# EAGLE design flying-blind-v3 (EAGLE 9.7.0)
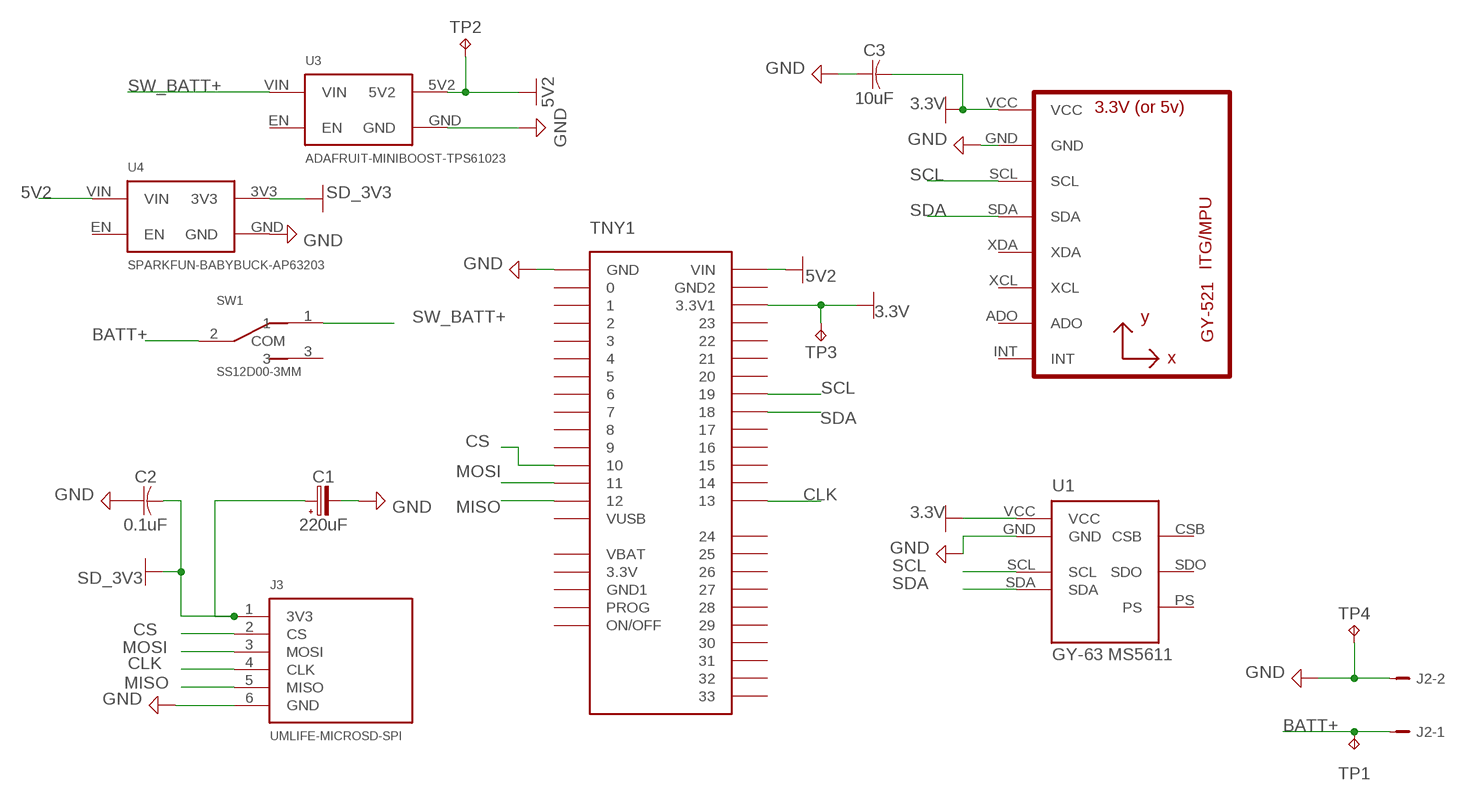
[diagram p0: schematic, sheet 1]

## Parts
C1  220uF  C-POLRADIAL-6.3MM-DIA  [CAPPRD250W80D630H800B]
C2  0.1uF  C-US_CHIP-1206(3216-METRIC)  [CAPC3216X135]
C3  10uF  C-US_CHIP-1206(3216-METRIC)  [CAPC3216X135]
J2  B2B-PH-K-S  [B2B-PH-K-S]
J3  UMLIFE-MICROSD-SPI  [UMLIFE-MICROSD-FINAL]
SW1  SS12D00-3MM  [SS12D00-3MM]
TNY1  Teensy 4.0  TEENSY4.0  [TEENSY4.0]
TP1  TPTP127R  [TP127R]
TP2  TPTP127R  [TP127R]
TP3  TPTP127R  [TP127R]
TP4  TPTP127R  [TP127R]
U1  GY-63 MS5611  GY-63-MS5611  [GY-63-MS5611-7P]
U2  GY-521MPU6050  [GY-521]
U3  ADAFRUIT-MINIBOOST-TPS61023  [ADAFRUIT-MINIBOOST-TPS61023]
U4  SPARKFUN-BABYBUCK-AP63203  [BABYBUCK-AP63203]

## Nets
3.3V: C3.2 TNY1.3.31(3.3V1) TP3.TP U1.VCC U2.VCC
5V2: TNY1.VIN TP2.TP U3.5V2 U4.VIN
BATT+: J2.1 SW1.2(COM) TP1.TP
CLK: J3.4(CLK) TNY1.13
CS: J3.2(CS) TNY1.10
GND: C1.2(-) C2.1 C3.1 J2.2 J3.6(GND) TNY1.GND TP4.TP U1.GND U2.GND U3.GND U4.GND
MISO: J3.5(MISO) TNY1.12
MOSI: J3.3(MOSI) TNY1.11
SCL: TNY1.19 U1.SCL U2.SCL
SD_3V3: C1.1(+) C2.2 J3.1(3V3) U4.3V3
SDA: TNY1.18 U1.SDA U2.SDA
SW_BATT+: SW1.1 U3.VIN
Unconnected: SW1.3 TNY1.0 TNY1.1 TNY1.2 TNY1.3 TNY1.3.30(3.3V) TNY1.4 TNY1.5 TNY1.6 TNY1.7 TNY1.8 TNY1.9 TNY1.14 TNY1.15 TNY1.16 TNY1.17 TNY1.20 TNY1.21 TNY1.22 TNY1.23 TNY1.24 TNY1.25 TNY1.26 TNY1.27 TNY1.28 TNY1.29 TNY1.30 TNY1.31 TNY1.32 TNY1.33 TNY1.GND1 TNY1.GND2 TNY1.ON/OFF TNY1.PROG TNY1.VBAT TNY1.VUSB U1.CSB U1.PS U1.SDO U2.ADO U2.INT U2.XCL U2.XDA U3.EN U4.EN

## Library data of the parts
C1 = Capacitor:C-POL: Capacitor Polarised - Generic
C2 C3 = Capacitor:C-US: Capacitor - ANSI
J2 = con-JST-PH:B2B-PH-K-S: JST-PH 2-way vertical TH
J3 = UMLIFE_MicroSD_Final_Measured:UMLIFE-MICROSD-SPI
SW1 = Jersvimc_SS12D00_3mm_Slide_Switch:SS12D00-3MM: SPDT 2-position slide switch. Physical terminal 2 is common; slider connects terminal 2 to terminal 1 or terminal 3 depending on position.
TNY1 = Phils teensy:TEENSY4.0
TP1-TP4 = PCB_Utilities:TP: Test Pad
U1 = GY-63_MS5611:GY-63-MS5611: GY-63 breakout using the MS5611 pressure sensor. Header order: VCC, GND, SCL, SDA, CSB, SDO, PS.
U2 = gy-521:GY-521
U3 = Adafruit_MiniBoost_TPS61023_4654:ADAFRUIT-MINIBOOST-TPS61023: Adafruit MiniBoost 5.2V @ 1A TPS61023, Product 4654. Carrier-module device.
U4 = SparkFun_BabyBuck_AP63203_COM-18357:SPARKFUN-BABYBUCK-AP63203: SparkFun BabyBuck 3.3V synchronous buck regulator breakout, AP63203, COM-18357.

## Board
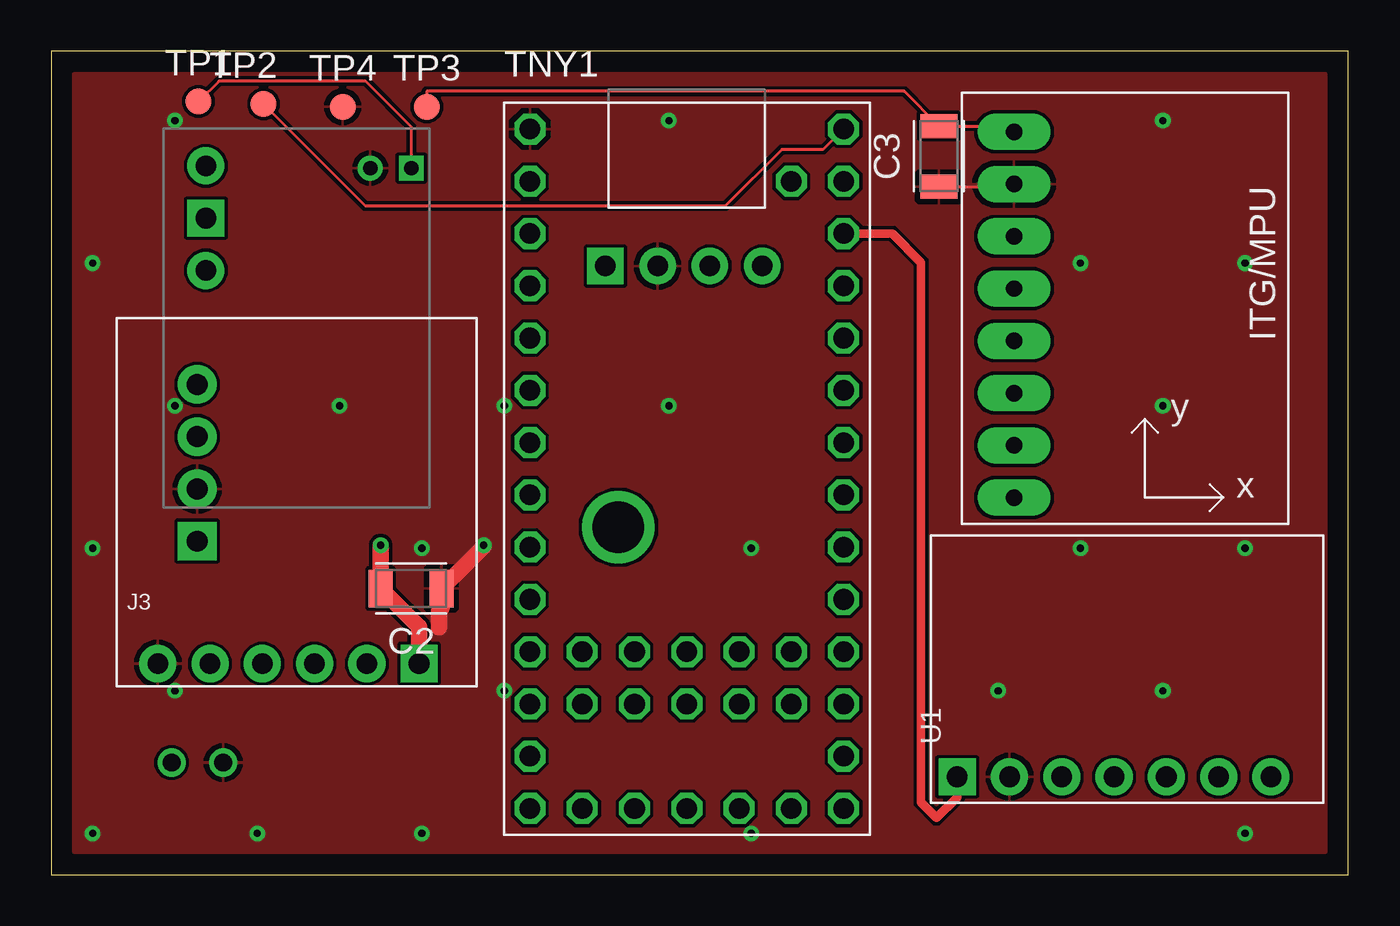
[diagram p1: board, top side]
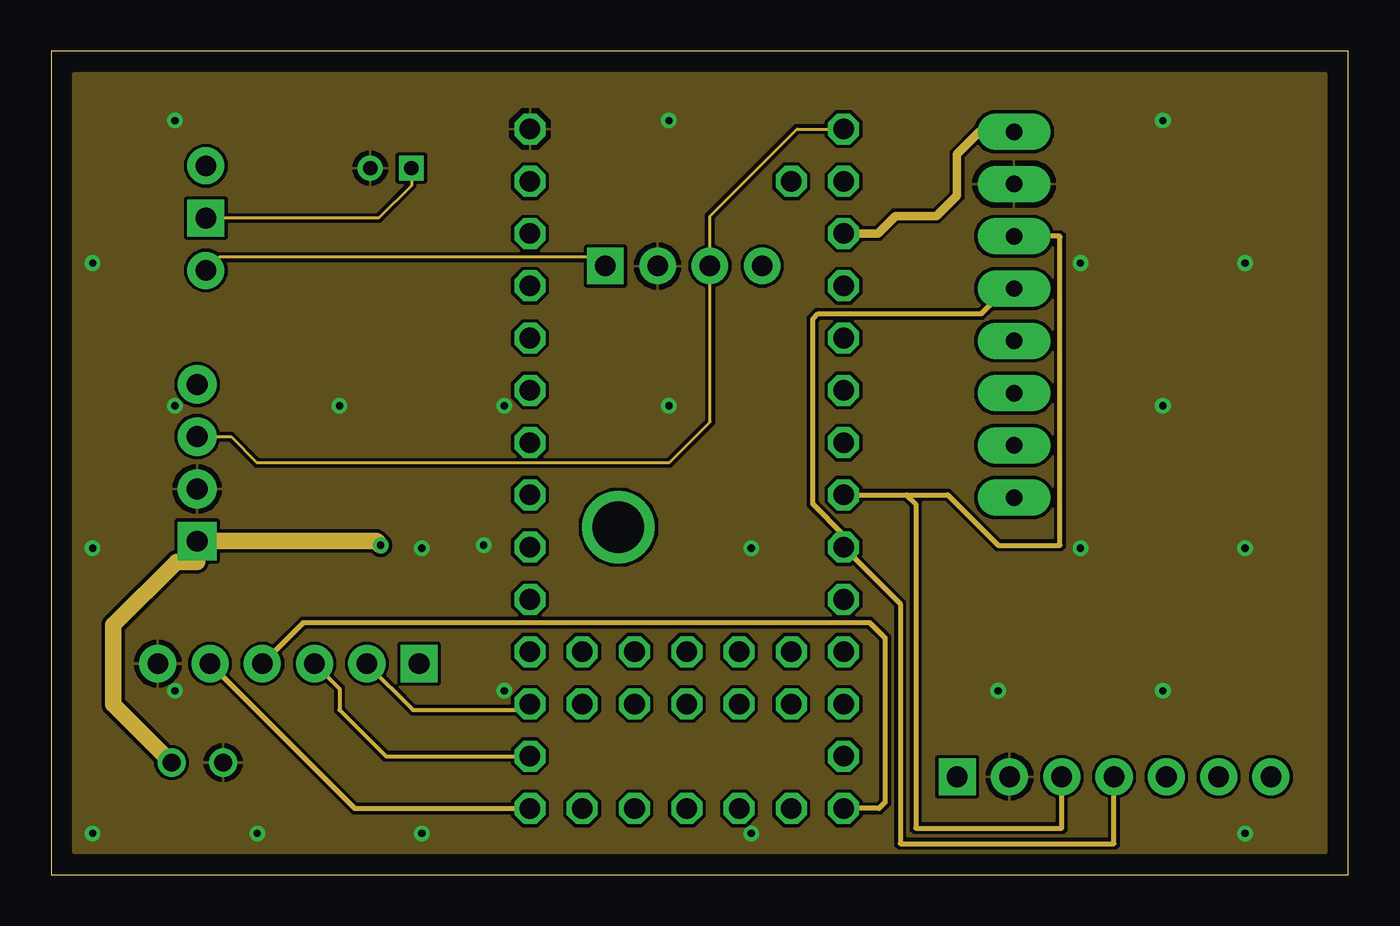
[diagram p2: board, inner layer Route16]
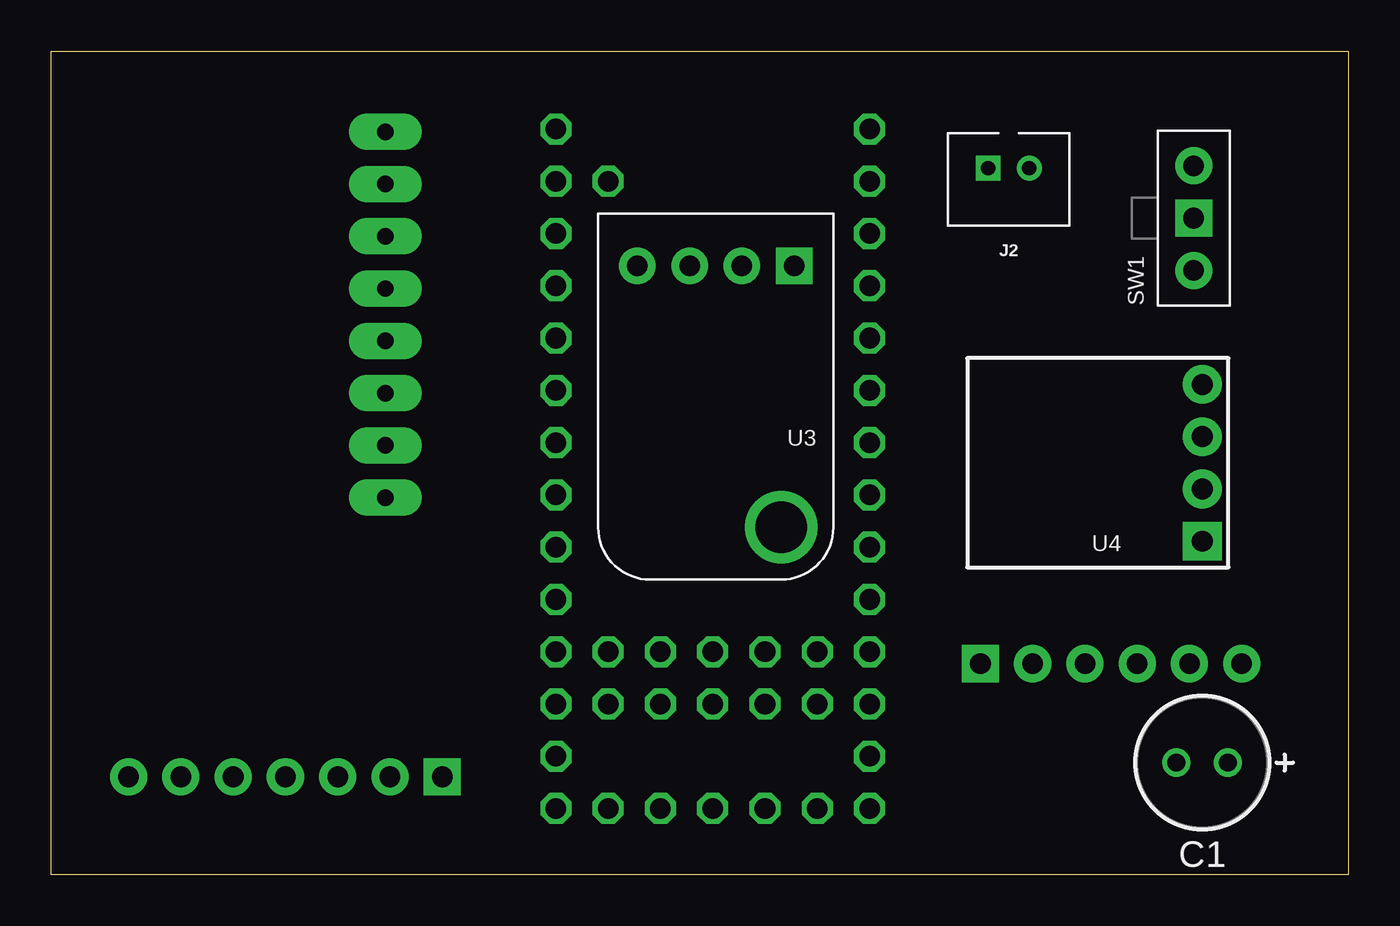
[diagram p3: board, bottom side, seen from below]

Size 63 x 40 mm. Coordinates in mm from the lower left corner, seen from the top.
Outline: 0,0 63,0 63,40 0,40 0,0
Copper layers (1*15): Top / Route16
Stack-up Default Layer Stack: Top CuFoil:007 0.035mm / Dielectric-1 User Defined 1.53mm / Bottom Signal CuFoil:007 0.035mm
Design rules: minimum drill size 0.35mm, minimum copper width 6mil, keepout clearance 0mil, drill distance 6mil, via restrict clearance 0mil, solder-mask clearance 0mil, dimension clearance 40mil, restrict clearance 0mil, copper clearance wire_polygon to wire_polygon 6mil, copper clearance wire_polygon to pad_smd 6mil, copper clearance wire_polygon to via 6mil, copper clearance pad_smd to pad_smd 6mil, copper clearance pad_smd to via 6mil, copper clearance via to via 6mil, copper clearance smd to pad (same net) 6mil, copper clearance smd to via (same net) 6mil, copper clearance smd to smd (same net) 6mil

### Footprints (pad centres in the part's own frame; a part is rotated, then mirrored left to right if it is on the bottom)
CAPPRD250W80D630H800B = drill 0.864 pad 1.372: 1 -1.25,0; 2 1.25,0
CAPC3216X135 = smd 1.165 x 1.815: 1 -1.475,0; 2 1.475,0
B2B-PH-K-S = drill 0.7 square: 1 1,0 | drill 0.7: 2 -1,0
UMLIFE-MICROSD-FINAL = drill 1 pad 1.8 square: 1 1.1,2.8 | drill 1 pad 1.8: 2 1.1,5.34; 3 1.1,7.88; 4 1.1,10.42; 5 1.1,12.96; 6 1.1,15.5
SS12D00-3MM = drill 1 pad 1.8: 1 -2.54,0; 3 2.54,0 | drill 1 pad 1.8 square: 2 0,0
TEENSY4.0 = drill 1 octagon: 0 -7.62,13.97; 1 -7.62,11.43; 2 -7.62,8.89; 3 -7.62,6.35; 3.30 -2.54,-16.51; 3.31 7.62,11.43; 4 -7.62,3.81; 5 -7.62,1.27; 6 -7.62,-1.27; 7 -7.62,-3.81; 8 -7.62,-6.35; 9 -7.62,-8.89; 10 -7.62,-11.43; 11 -7.62,-13.97; 12 -7.62,-16.51; 13 7.62,-16.51; 14 7.62,-13.97; 15 7.62,-11.43; 16 7.62,-8.89; 17 7.62,-6.35; 18 7.62,-3.81; 19 7.62,-1.27; 20 7.62,1.27; 21 7.62,3.81; 22 7.62,6.35; 23 7.62,8.89; 24 5.08,-11.43; 25 5.08,-8.89; 26 2.54,-11.43; 27 2.54,-8.89; 28 0,-11.43; 29 0,-8.89; 30 -2.54,-11.43; 31 -2.54,-8.89; 32 -5.08,-11.43; 33 -5.08,-8.89; GND -7.62,16.51; GND1 0,-16.51; GND2 7.62,13.97; ON/OFF 5.08,-16.51; PROG 2.54,-16.51; VBAT -5.08,-16.51; VIN 7.62,16.51; VUSB 5.08,13.97
TP127R = smd 1.27 x 1.27: TP 0,0
GY-63-MS5611-7P = drill 1 pad 1.8: CSB 0,-10.16; GND 0,-2.54; PS 0,-15.24; SCL 0,-5.08; SDA 0,-7.62; SDO 0,-12.7 | drill 1 pad 1.8 square: VCC 0,0
GY-521 = drill 0.8 pad 1.778 long: ADO -8.89,-6.35; GND -8.89,6.35; INT -8.89,-8.89; SCL -8.89,3.81; SDA -8.89,1.27; VCC -8.89,8.89; XCL -8.89,-3.81; XDA -8.89,-1.27
ADAFRUIT-MINIBOOST-TPS61023 = drill 1 pad 1.778: 5V2 6.985,2.54; EN 9.525,2.54; GND 4.445,2.54 | drill 2.5 pad 3.5: MH 2.54,15.24 | drill 1 pad 1.778 square: VIN 1.905,2.54
BABYBUCK-AP63203 = drill 1.016 pad 1.88 square: 3V3 1.27,8.89 | drill 1.016 pad 1.88: EN 1.27,1.27; GND 1.27,6.35; VIN 1.27,3.81

### Placement (x,y rotation side)
C1  7.09,5.44 180 bottom
C2  17.47,13.9 180 top
C3  43.12,34.9 90 top
J2  16.49,34.33 180 bottom
J3  20.66,9.15 90 top
SW1  7.5,31.9 90 bottom
TNY1  30.87,19.72 0 top
TP1  7.14,37.56 0 top
TP2  10.31,37.44 0 top
TP3  18.23,37.31 0 top
TP4  14.15,37.31 0 top
U1  44.01,4.75 90 top
U2  55.66,27.2 0 top
U3  25.01,32.11 180 bottom
U4  5.81,25.09 180 bottom

### Tracks (layer width: path | path; a pad name or v marks a point on that pad's centre or on a via)
3.3V
  Top 0.152: TP3.TP 18.23,38.06 41.44,38.06 C3.2 46.49,36.38 U2.VCC
  Top 0.406: TNY1.3.31 40.85,31.15 42.25,29.75 42.25,3.5 43,2.75 44.01,3.76 U1.VCC
  Route16 0.406: TNY1.3.31 40.15,31.15 41,32 43,32 44,33 44,35 45.09,36.09 U2.VCC
5V2
  Top 0.152: TP2.TP 15.25,32.5 32.76,32.5 35.49,35.23 37.49,35.23 TNY1.VIN
  Route16 0.152: U4.VIN 8.72,21.28 10,20 30,20 32,22 U3.5V2 32,31.99 36.23,36.23 TNY1.VIN
BATT+
  Top 0.152: J2.1 17.49,36.33 15.26,38.56 8.14,38.56 TP1.TP
  Route16 0.152: J2.1 17.49,33.49 15.9,31.9 SW1.2
CLK
  Route16 0.254: J3.4 12.25,12.25 39.75,12.25 40.5,11.5 40.5,3.5 40.21,3.21 TNY1.13
CS
  Route16 0.203: J3.2 17.57,8 22.96,8 TNY1.10
GND  (via drill 0.35 layers 1-15)
  Top 0.152: C3.1 46.64,33.42 U2.GND
  Top 0.813: 18.95,12.95 18.83,12.83 18.83,12 | C2.1 21,15.95 v21,16
  other vias: 50,29.71 54,36.64 2,29.71 22,22.78 14,22.78 58,15.86 50,15.86 10,2 6,8.93 58,29.71 34,15.86 18,15.86 30,22.78 54,8.93 58,2 30,36.64 6,36.64 2,15.86 46,8.93 6,22.78 18,2 22,8.93 34,2 54,22.78 2,2
  pour Top: -2,43 66,43 66,-7 -2,-7
  pour Route16: -3,45 68,45 68,-10 -3,-10
MISO
  Route16 0.254: J3.5 14.74,3.21 TNY1.12
MOSI
  Route16 0.203: J3.3 14,9.03 14,8 16.25,5.75 TNY1.11
SCL
  Route16 0.254: U2.SCL 48.98,31.02 49,31 49,16 46,16 43.55,18.45 TNY1.19 41.55,18.45 42,18 42,2.25 49.09,2.25 U1.SCL
SD_3V3  (via drill 0.35 layers 1-15)
  Top 0.813: v16,16 C2.2 17.86,12.03 J3.1
  Route16 0.813: v16,16 15.8,16.2 U4.3V3 7.08,15.2 6.08,15.2 3,12.12 3,8.28 C1.1
SDA
  Route16 0.254: U2.SDA 46.59,28.66 45.18,27.25 37.25,27.25 37,27 37,18 38.49,16.51 TNY1.18 41.25,13.15 41.25,1.5 51.63,1.5 U1.SDA
SW_BATT+
  Route16 0.152: SW1.1 8.14,30 26.49,30 U3.VIN